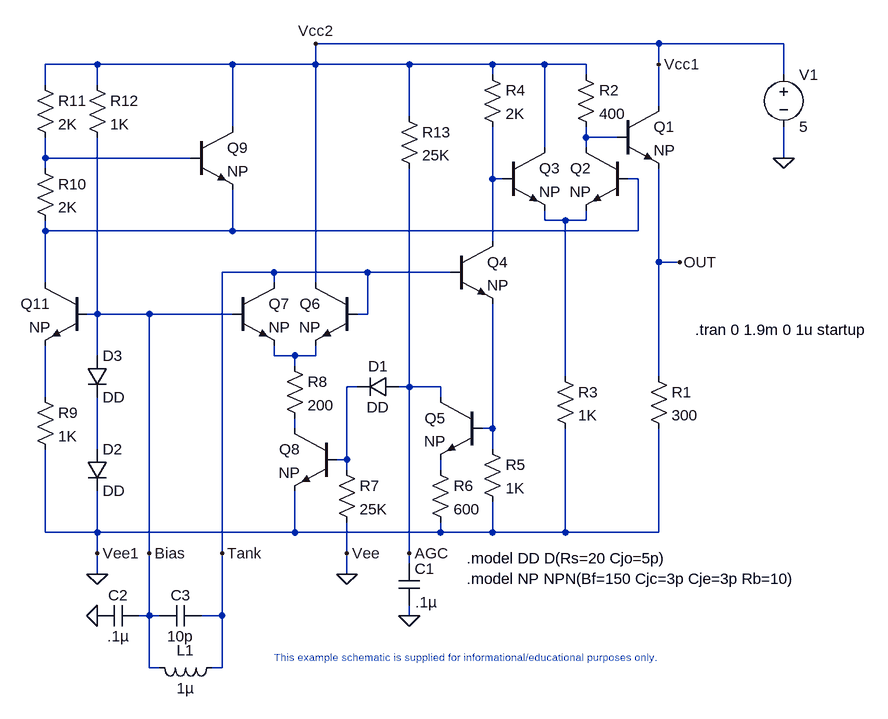
[diagram p0: schematic MC1648.asc]
MC1648.asc, the LTspice schematic file:
Version 4
SHEET 1 1348 1188
WIRE 128 32 -400 32
WIRE 320 32 128 32
WIRE -736 64 -816 64
WIRE -528 64 -736 64
WIRE -400 64 -400 32
WIRE -400 64 -528 64
WIRE -256 64 -400 64
WIRE -128 64 -256 64
WIRE -48 64 -128 64
WIRE 16 64 -48 64
WIRE 128 64 128 32
WIRE -128 80 -128 64
WIRE 16 80 16 64
WIRE 320 80 320 32
WIRE -816 96 -816 64
WIRE -736 96 -736 64
WIRE 128 128 128 64
WIRE -256 144 -256 64
WIRE -528 160 -528 64
WIRE 16 176 16 160
WIRE 64 176 16 176
WIRE -48 192 -48 64
WIRE 16 192 16 176
WIRE -816 208 -816 176
WIRE -592 208 -816 208
WIRE 320 208 320 160
WIRE -816 224 -816 208
WIRE -128 240 -128 160
WIRE -112 240 -128 240
WIRE 96 240 80 240
WIRE -48 304 -48 288
WIRE -16 304 -48 304
WIRE 16 304 16 288
WIRE 16 304 -16 304
WIRE -816 320 -816 304
WIRE -528 320 -528 256
WIRE -528 320 -816 320
WIRE 96 320 96 240
WIRE 96 320 -528 320
WIRE -128 336 -128 240
WIRE 128 368 128 224
WIRE 160 368 128 368
WIRE -464 384 -544 384
WIRE -320 384 -464 384
WIRE -192 384 -320 384
WIRE -816 400 -816 320
WIRE -464 400 -464 384
WIRE -400 400 -400 64
WIRE -736 448 -736 176
WIRE -736 448 -752 448
WIRE -656 448 -736 448
WIRE -528 448 -656 448
WIRE -320 448 -320 384
WIRE -320 448 -336 448
WIRE -736 512 -736 448
WIRE -464 512 -464 496
WIRE -432 512 -464 512
WIRE -400 512 -400 496
WIRE -400 512 -432 512
WIRE -432 528 -432 512
WIRE -16 544 -16 304
WIRE 128 544 128 368
WIRE -336 560 -352 560
WIRE -256 560 -256 224
WIRE -256 560 -272 560
WIRE -208 560 -256 560
WIRE -816 576 -816 496
WIRE -208 576 -208 560
WIRE -432 624 -432 608
WIRE -128 624 -128 432
WIRE -128 624 -144 624
WIRE -736 656 -736 576
WIRE -128 656 -128 624
WIRE -352 672 -352 560
WIRE -352 672 -368 672
WIRE -352 688 -352 672
WIRE -208 688 -208 672
WIRE -816 784 -816 656
WIRE -736 784 -736 720
WIRE -736 784 -816 784
WIRE -432 784 -432 720
WIRE -432 784 -736 784
WIRE -208 784 -208 768
WIRE -208 784 -432 784
WIRE -128 784 -128 736
WIRE -128 784 -208 784
WIRE -16 784 -16 624
WIRE -16 784 -128 784
WIRE 128 784 128 624
WIRE 128 784 -16 784
WIRE -736 816 -736 784
WIRE -656 816 -656 448
WIRE -544 816 -544 384
WIRE -352 816 -352 768
WIRE -256 816 -256 560
WIRE -256 832 -256 816
WIRE -736 848 -736 816
WIRE -352 848 -352 816
WIRE -656 912 -656 816
WIRE -656 912 -672 912
WIRE -640 912 -656 912
WIRE -544 912 -544 816
WIRE -544 912 -576 912
WIRE -256 912 -256 896
WIRE -656 992 -656 912
WIRE -640 992 -656 992
WIRE -544 992 -544 912
WIRE -544 992 -560 992
FLAG 128 64 Vcc1
FLAG 160 368 OUT
FLAG -256 816 AGC
FLAG -352 816 Vee
FLAG -400 32 Vcc2
FLAG -544 816 Tank
FLAG -656 816 Bias
FLAG -736 816 Vee1
FLAG -736 848 0
FLAG -352 848 0
FLAG -256 912 0
FLAG 320 208 0
FLAG -736 912 0
SYMBOL npn 64 128 R0
SYMATTR InstName Q1
SYMATTR Value NP
SYMBOL res 112 528 R0
SYMATTR InstName R1
SYMATTR Value 300
SYMBOL npn 80 192 M0
SYMATTR InstName Q2
SYMATTR Value NP
SYMBOL npn -112 192 R0
SYMATTR InstName Q3
SYMATTR Value NP
SYMBOL res 0 64 R0
SYMATTR InstName R2
SYMATTR Value 400
SYMBOL res -32 528 R0
SYMATTR InstName R3
SYMATTR Value 1K
SYMBOL res -144 64 R0
SYMATTR InstName R4
SYMATTR Value 2K
SYMBOL res -144 640 R0
SYMATTR InstName R5
SYMATTR Value 1K
SYMBOL npn -192 336 R0
SYMATTR InstName Q4
SYMATTR Value NP
SYMBOL npn -144 576 M0
SYMATTR InstName Q5
SYMATTR Value NP
SYMBOL diode -272 544 R90
WINDOW 0 0 32 VBottom 2
WINDOW 3 32 32 VTop 2
SYMATTR InstName D1
SYMATTR Value DD
SYMBOL res -224 672 R0
SYMATTR InstName R6
SYMATTR Value 600
SYMBOL npn -336 400 M0
SYMATTR InstName Q6
SYMATTR Value NP
SYMBOL npn -528 400 R0
SYMATTR InstName Q7
SYMATTR Value NP
SYMBOL res -368 672 R0
SYMATTR InstName R7
SYMATTR Value 25K
SYMBOL npn -368 624 M0
SYMATTR InstName Q8
SYMATTR Value NP
SYMBOL res -448 512 R0
SYMATTR InstName R8
SYMATTR Value 200
SYMBOL npn -592 160 R0
SYMATTR InstName Q9
SYMATTR Value NP
SYMBOL diode -752 656 R0
SYMATTR InstName D2
SYMATTR Value DD
SYMBOL res -832 560 R0
SYMATTR InstName R9
SYMATTR Value 1K
SYMBOL res -832 208 R0
SYMATTR InstName R10
SYMATTR Value 2K
SYMBOL res -832 80 R0
SYMATTR InstName R11
SYMATTR Value 2K
SYMBOL npn -752 400 M0
SYMATTR InstName Q11
SYMATTR Value NP
SYMBOL res -752 80 R0
SYMATTR InstName R12
SYMATTR Value 1K
SYMBOL res -272 128 R0
SYMATTR InstName R13
SYMATTR Value 25K
SYMBOL cap -272 832 R0
WINDOW 3 25 59 Left 2
SYMATTR Value .1µ
SYMATTR InstName C1
SYMBOL voltage 320 64 R0
SYMATTR InstName V1
SYMATTR Value 5
SYMBOL cap -672 896 R90
WINDOW 0 0 32 VBottom 2
WINDOW 3 32 32 VTop 2
SYMATTR InstName C2
SYMATTR Value .1µ
SYMBOL ind -544 976 R90
WINDOW 0 5 56 VBottom 2
WINDOW 3 32 56 VTop 2
SYMATTR InstName L1
SYMATTR Value 1µ
SYMBOL cap -576 896 R90
WINDOW 0 0 32 VBottom 2
WINDOW 3 32 32 VTop 2
SYMATTR InstName C3
SYMATTR Value 10p
SYMBOL diode -752 512 R0
SYMATTR InstName D3
SYMATTR Value DD
TEXT -168 824 Left 2 !.model DD D(Rs=20 Cjo=5p)\n.model NP NPN(Bf=150 Cjc=3p Cje=3p Rb=10)
TEXT 184 472 Left 2 !.tran 0 1.9m 0 1u startup
TEXT -464 976 Left 1 ;This example schematic is supplied for informational/educational purposes only.

The netlist it stands for:
* MC1648.asc
Q1 Vcc2 N001 OUT 0 NP
R1 OUT 0 300
Q2 N001 N004 N005 0 NP
Q3 Vcc2 N003 N005 0 NP
R2 Vcc2 N001 400
R3 N005 0 1K
R4 Vcc2 N003 2K
R5 N010 0 1K
Q4 N003 Tank N010 0 NP
Q5 AGC N010 N012 0 NP
D1 AGC N007 DD
R6 N012 0 600
Q6 Vcc2 Tank N006 0 NP
Q7 Tank Bias N006 0 NP
R7 N007 0 25K
Q8 N009 N007 0 0 NP
R8 N006 N009 200
Q9 Vcc2 N002 N004 0 NP
D2 N011 0 DD
R9 N008 0 1K
R10 N002 N004 2K
R11 Vcc2 N002 2K
Q11 N004 Bias N008 0 NP
R12 Vcc2 Bias 1K
R13 Vcc2 AGC 25K
C1 AGC 0 .1µ
V1 Vcc2 0 5
C2 Bias 0 .1µ
L1 Tank Bias 1µ
C3 Tank Bias 10p
D3 Bias N011 DD
.model D D
.lib standard.dio
.model NPN NPN
.model PNP PNP
.lib standard.bjt
.model DD D(Rs=20 Cjo=5p)
.model NP NPN(Bf=150 Cjc=3p Cje=3p Rb=10)
.tran 0 1.9m 0 1u startup
* This example schematic is supplied for informational/educational purposes only.
.backanno
.end